# EAGLE design 20inputAND (EAGLE 7.5.0)
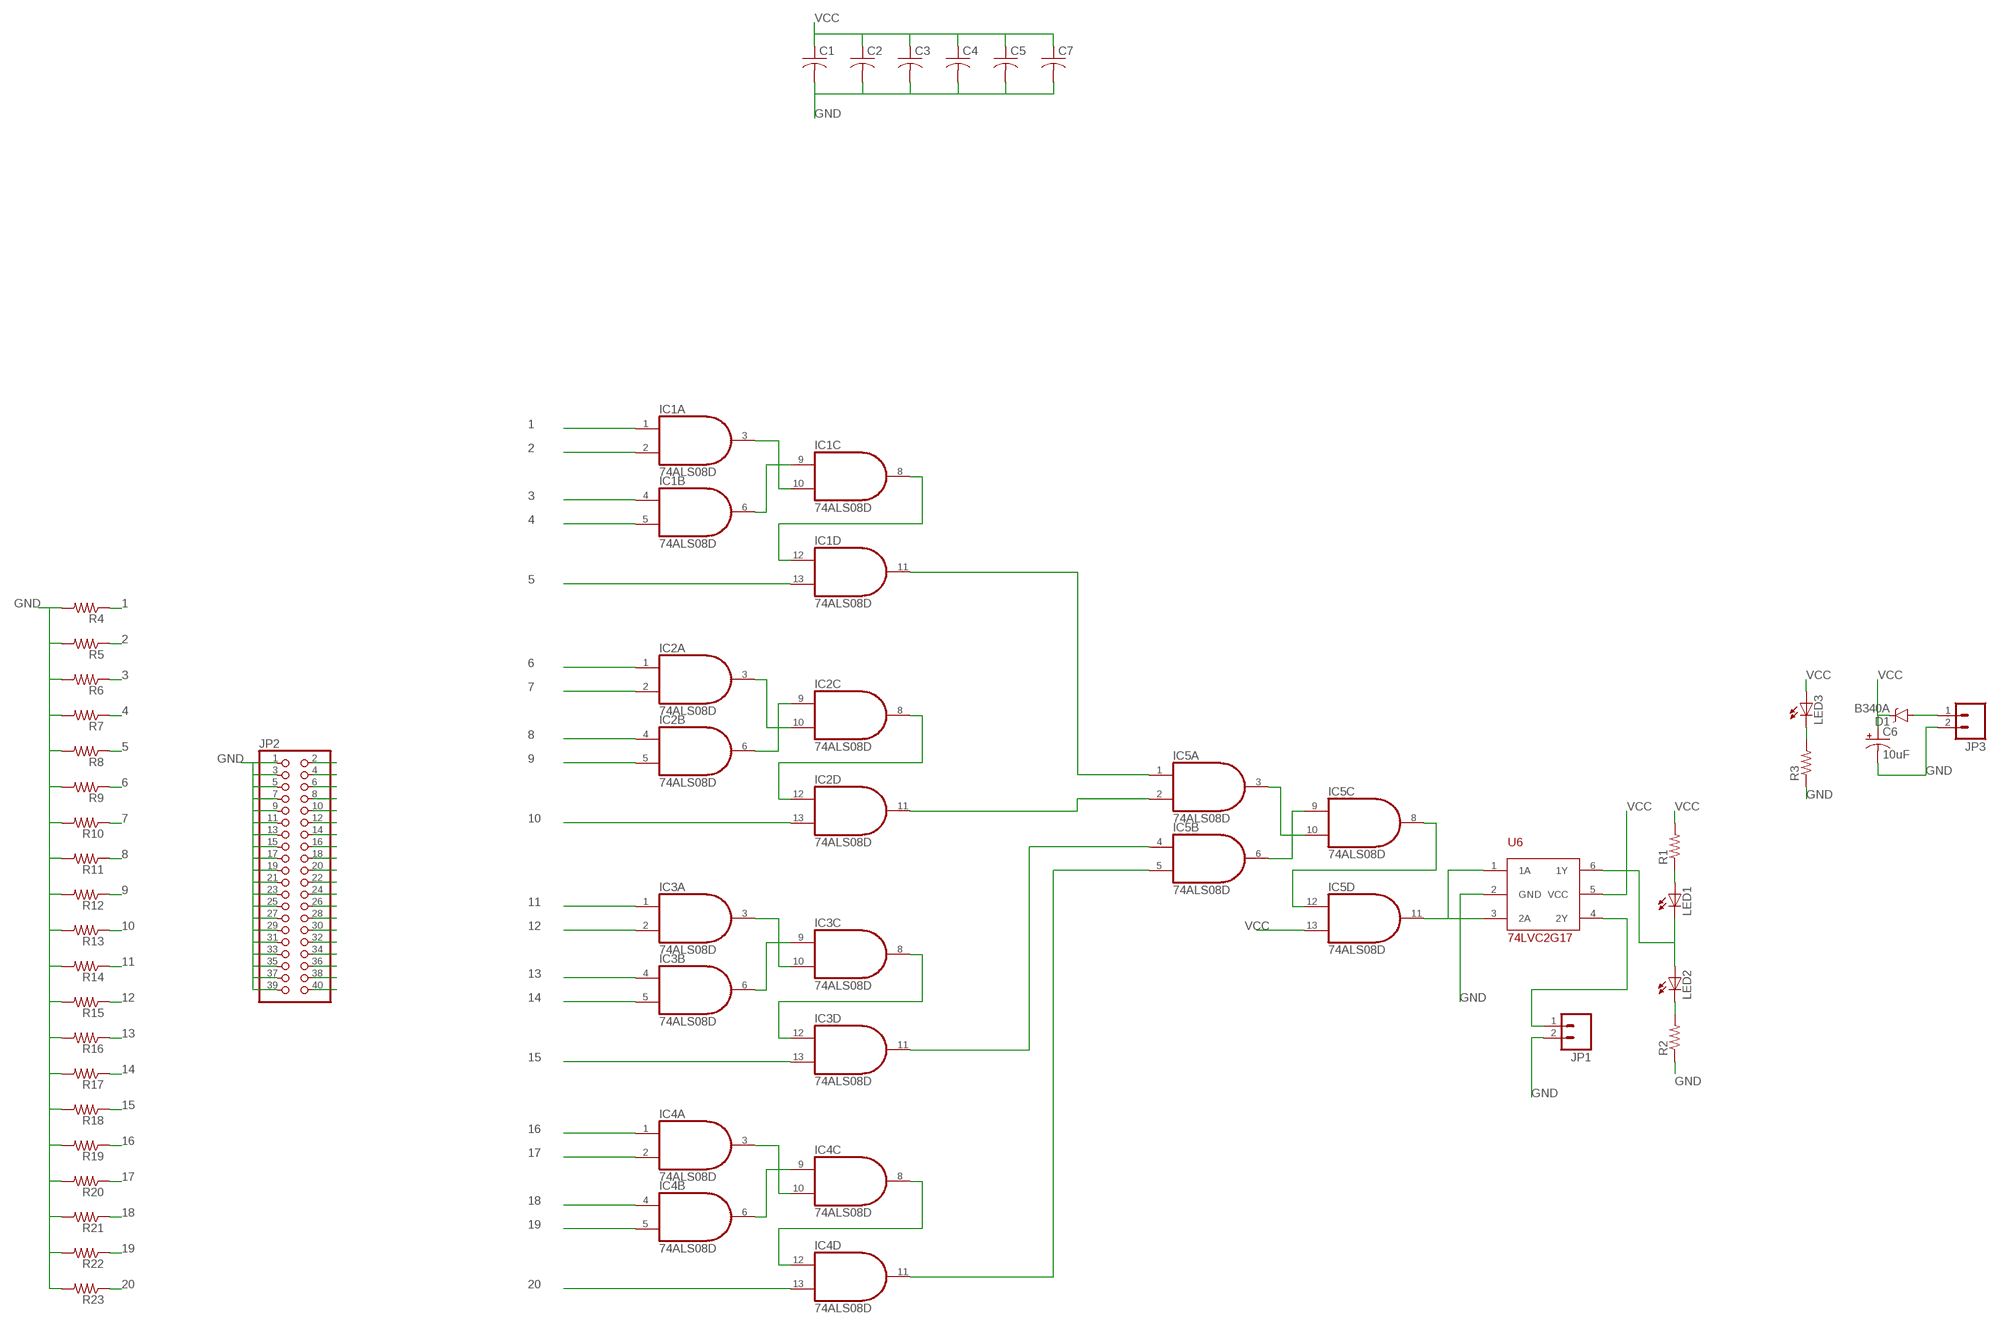
[diagram p0: schematic, sheet 1]

## Parts
C1  C-USC0603  [C0603]
C2  C-USC0603  [C0603]
C3  C-USC0603  [C0603]
C4  C-USC0603  [C0603]
C5  C-USC0603  [C0603]
C6  10uF  10UF-16V-10%(TANT)  [EIA3216]
C7  C-USC0603  [C0603]
D1  B340A  DIODE-SCHOTTKY-B340A  [SMA-DIODE]
IC1  74ALS08D  [SO14]
IC2  74ALS08D  [SO14]
IC3  74ALS08D  [SO14]
IC4  74ALS08D  [SO14]
IC5  74ALS08D  [SO14]
JP1  M02PTH  [1X02]
JP2  PINHD-2X20  [2X20]
JP3  M02PTH  [1X02]
LED1  LEDCHIPLED_1206  [CHIPLED_1206]
LED2  LEDCHIPLED_1206  [CHIPLED_1206]
LED3  LEDCHIPLED_0805  [CHIPLED_0805]
R1  R-US_R0603  [R0603]
R2  R-US_R0603  [R0603]
R3  R-US_R0603  [R0603]
R4  R-US_R0603  [R0603]
R5  R-US_R0603  [R0603]
R6  R-US_R0603  [R0603]
R7  R-US_R0603  [R0603]
R8  R-US_R0603  [R0603]
R9  R-US_R0603  [R0603]
R10  R-US_R0603  [R0603]
R11  R-US_R0603  [R0603]
R12  R-US_R0603  [R0603]
R13  R-US_R0603  [R0603]
R14  R-US_R0603  [R0603]
R15  R-US_R0603  [R0603]
R16  R-US_R0603  [R0603]
R17  R-US_R0603  [R0603]
R18  R-US_R0603  [R0603]
R19  R-US_R0603  [R0603]
R20  R-US_R0603  [R0603]
R21  R-US_R0603  [R0603]
R22  R-US_R0603  [R0603]
R23  R-US_R0603  [R0603]
U$2  74LVC2G14/7  [SOT23-6]

## Nets
1: IC1.1(A:I0) JP2.2 R4.1
2: IC1.2(A:I1) JP2.4 R5.1
3: IC1.4(B:I0) JP2.6 R6.1
4: IC1.5(B:I1) JP2.8 R7.1
5: IC1.13(D:I1) JP2.10 R8.1
6: IC2.1(A:I0) JP2.12 R9.1
7: IC2.2(A:I1) JP2.14 R10.1
8: IC2.4(B:I0) JP2.16 R11.1
9: IC2.5(B:I1) JP2.18 R12.1
10: IC2.13(D:I1) JP2.20 R13.1
11: IC3.1(A:I0) JP2.22 R14.1
12: IC3.2(A:I1) JP2.24 R15.1
13: IC3.4(B:I0) JP2.26 R16.1
14: IC3.5(B:I1) JP2.28 R17.1
15: IC3.13(D:I1) JP2.30 R18.1
16: IC4.1(A:I0) JP2.32 R19.1
17: IC4.2(A:I1) JP2.34 R20.1
18: IC4.4(B:I0) JP2.36 R21.1
19: IC4.5(B:I1) JP2.38 R22.1
20: IC4.13(D:I1) JP2.40 R23.1
GND: C1.2 C2.2 C3.2 C4.2 C5.2 C6.C(-) C7.2 JP1.2 JP2.1 JP2.3 JP2.5 JP2.7 JP2.9 JP2.11 JP2.13 JP2.15 JP2.17 JP2.19 JP2.21 JP2.23 JP2.25 JP2.27 JP2.29 JP2.31 JP2.33 JP2.35 JP2.37 JP2.39 JP3.2 R2.1 R3.1 R4.2 R5.2 R6.2 R7.2 R8.2 R9.2 R10.2 R11.2 R12.2 R13.2 R14.2 R15.2 R16.2 R17.2 R18.2 R19.2 R20.2 R21.2 R22.2 R23.2 U$2.2(GND)
N$1: LED1.A R1.1
N$2: D1.A JP3.1
N$3: LED2.C R2.2
N$5: IC1.6(B:O) IC1.9(C:I0)
N$6: IC1.3(A:O) IC1.10(C:I1)
N$7: IC1.8(C:O) IC1.12(D:I0)
N$8: LED3.C R3.2
N$9: IC1.11(D:O) IC5.1(A:I0)
N$11: IC2.3(A:O) IC2.10(C:I1)
N$12: IC2.6(B:O) IC2.9(C:I0)
N$13: IC3.6(B:O) IC3.9(C:I0)
N$14: IC3.3(A:O) IC3.10(C:I1)
N$15: IC2.8(C:O) IC2.12(D:I0)
N$16: IC4.6(B:O) IC4.9(C:I0)
N$17: IC4.3(A:O) IC4.10(C:I1)
N$18: IC2.11(D:O) IC5.2(A:I1)
N$19: IC5.6(B:O) IC5.9(C:I0)
N$20: IC5.3(A:O) IC5.10(C:I1)
N$21: LED1.C LED2.A U$2.6(1Y)
N$22: IC5.11(D:O) U$2.1(1A) U$2.3(2A)
N$24: IC3.8(C:O) IC3.12(D:I0)
N$25: JP1.1 U$2.4(2Y)
N$27: IC3.11(D:O) IC5.4(B:I0)
N$33: IC4.8(C:O) IC4.12(D:I0)
N$36: IC4.11(D:O) IC5.5(B:I1)
N$42: IC5.8(C:O) IC5.12(D:I0)
VCC: C1.1 C2.1 C3.1 C4.1 C5.1 C6.A(+) C7.1 D1.C IC5.13(D:I1) LED3.A R1.2 U$2.5(VCC)

## Notes on the sheet
- U6
- 74LVC2G17

## Power pins joined to a net without a drawn wire
GND: IC1.7(P:GND) IC2.7(P:GND) IC3.7(P:GND) IC4.7(P:GND) IC5.7(P:GND)
VCC: IC1.14(P:VCC) IC2.14(P:VCC) IC3.14(P:VCC) IC4.14(P:VCC) IC5.14(P:VCC)

## Library data of the parts
C1-C5 C7 = adafruit:C-US: CAPACITOR, American symbol
C6 = SparkFun-Capacitors:10UF-16V-10%(TANT): CAP-00811 1206/EIA-3216 Tantalum capacitor; PROD_ID: CAP-00811
D1 = SparkFun-DiscreteSemi:DIODE-SCHOTTKY: Schottky diodes in SFE's production catalog BAT20J 1A 23V 0.62Vf RB751 120mA 40V 0.37Vf PMEG4005EJ 0.5A 40V 0.42Vf MBRA140 1A 40V 0.5Vf B340A 3A 40V SMA; PROD_ID: DIO-09886
IC1-IC5 = 74xx-us:74*08: Quad 2-input AND gate
JP1 JP3 = SparkFun-Connectors:M02: Standard 2-pin 0.1" header. Use with - straight break away headers ( PRT-00116) - right angle break away headers (PRT-00553) - swiss pins (PRT-00743) - machine pins (PRT-00117) - female headers (PRT-00115) Molex polarized connector foot print use with: PRT-08233 with associated crimp pins and housings. 2.54_SCREWTERM for use with PRT-10571. 3.5mm Screw Terminal footprints for PRT-08084 5mm Screw Terminal footprints for use with PRT-08432
JP2 = adafruit:PINHD-2X20: PIN HEADER
LED1-LED3 = adafruit:LED: LED OSRAM: - CHIPLED LG R971, LG N971, LY N971, LG Q971, LY Q971, LO R971, LY R971 LH N974, LH R974 LS Q976, LO Q976, LY Q976 LO Q996 - Hyper CHIPLED LW Q18S LB Q993, LB Q99A, LB R99A - SideLED LS A670, LO A670, LY A670, LG A670, LP A670 LB A673, LV A673, LT A673, LW A673 LH A674 LY A675 LS A676, LA A676, LO A676, LY A676, LW A676 LS A679, LY A679, LG A679 - Hyper Micro SIDELED® LS Y876, LA Y876, LO Y876, LY Y876 LT Y87S - SmartLED LW L88C, LW L88S LB L89C, LB L89S, LG L890 LS L89K, LO L89K, LY L89K LS L896, LA L896, LO L896, LY L896 - TOPLED LS T670, LO T670, LY T670, LG T670, LP T670 LSG T670, LSP T670, LSY T670, LOP T670, LYG T670 LG T671, LOG T671, LSG T671 LB T673, LV T673, LT T673, LW T673 LH T674 LS T676, LA T676, LO T676, LY T676, LB T676, LH T676, LSB T676, LW T676 LB T67C, LV T67C, LT T67C, LS T67K, LO T67K, LY T67K, LW E67C LS E67B, LA E67B, LO E67B, LY E67B, LB E67C, LV E67C, LT E67C LW T67C LS T679, LY T679, LG T679 LS T770, LO T770, LY T770, LG T770, LP T770 LB T773, LV T773, LT T773, LW T773 LH T774 LS E675, LA E675, LY E675, LS T675 LS T776, LA T776, LO T776, LY T776, LB T776 LHGB T686 LT T68C, LB T68C - Hyper Mini TOPLED® LB M676 - Mini TOPLED Santana® LG M470 LS M47K, LO M47K, LY M47K Source: http://www.osram.convergy.de/
R1-R23 = adafruit:R-US_: RESISTOR, American symbol
U$2 = _CustomParts:74LVC2G14/7

## Board
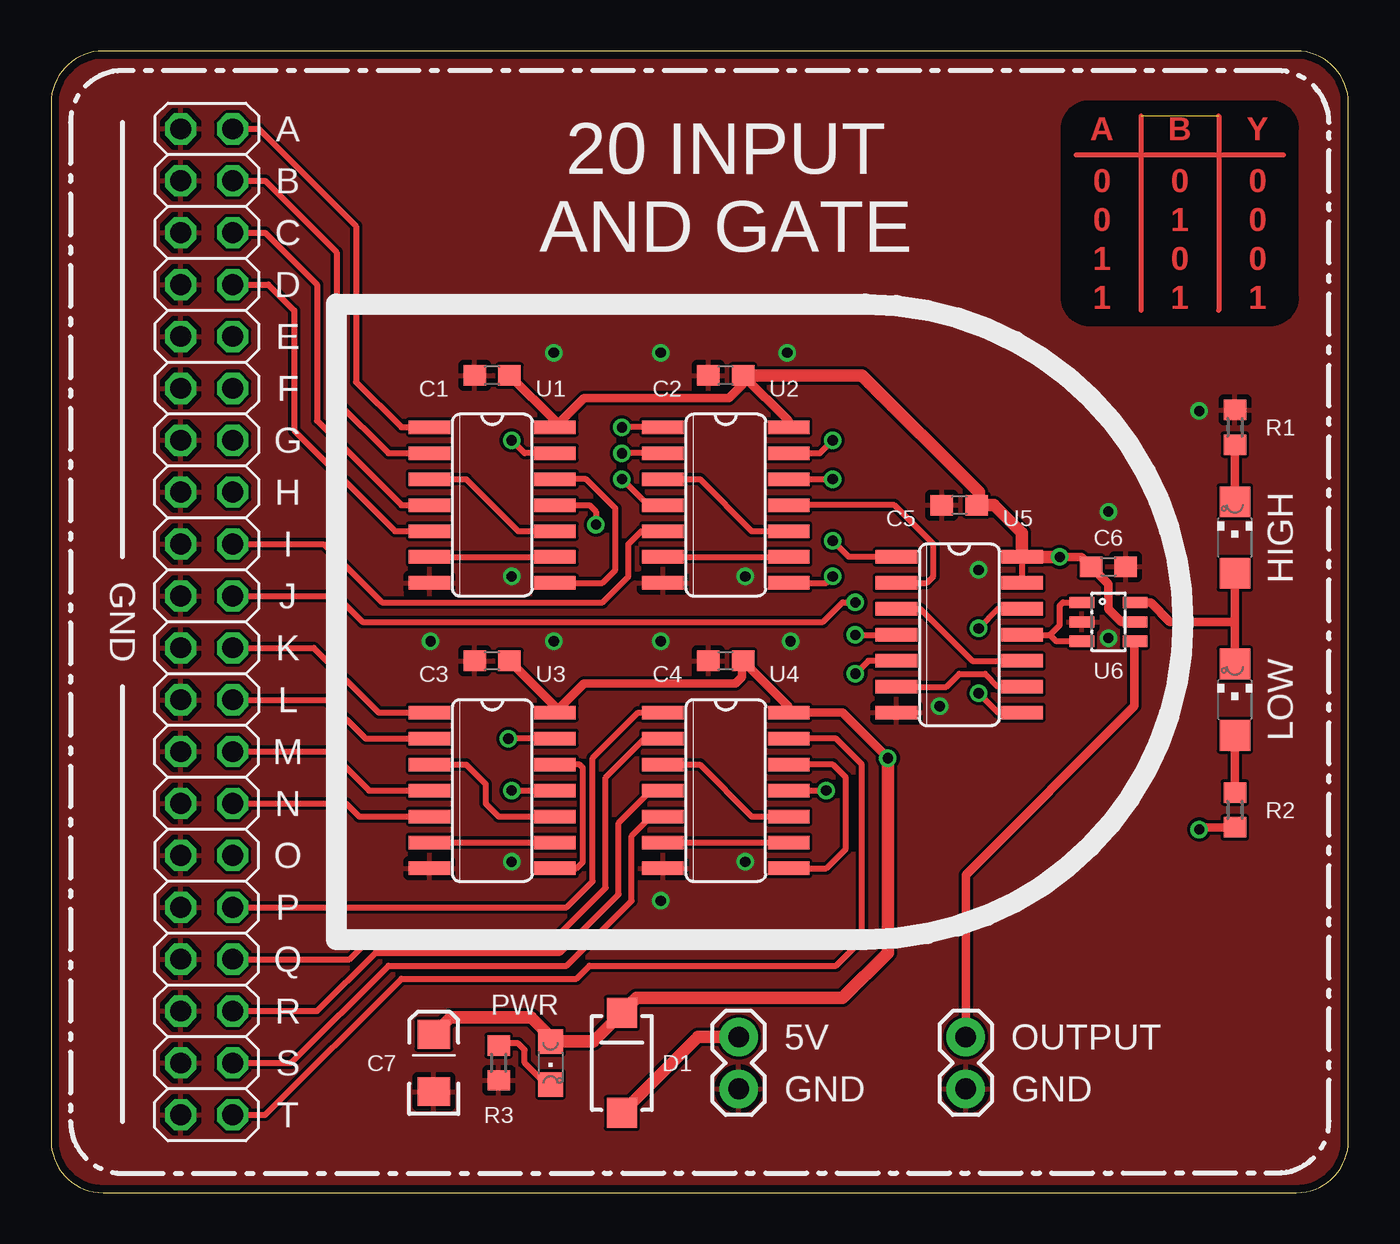
[diagram p1: board, top side]
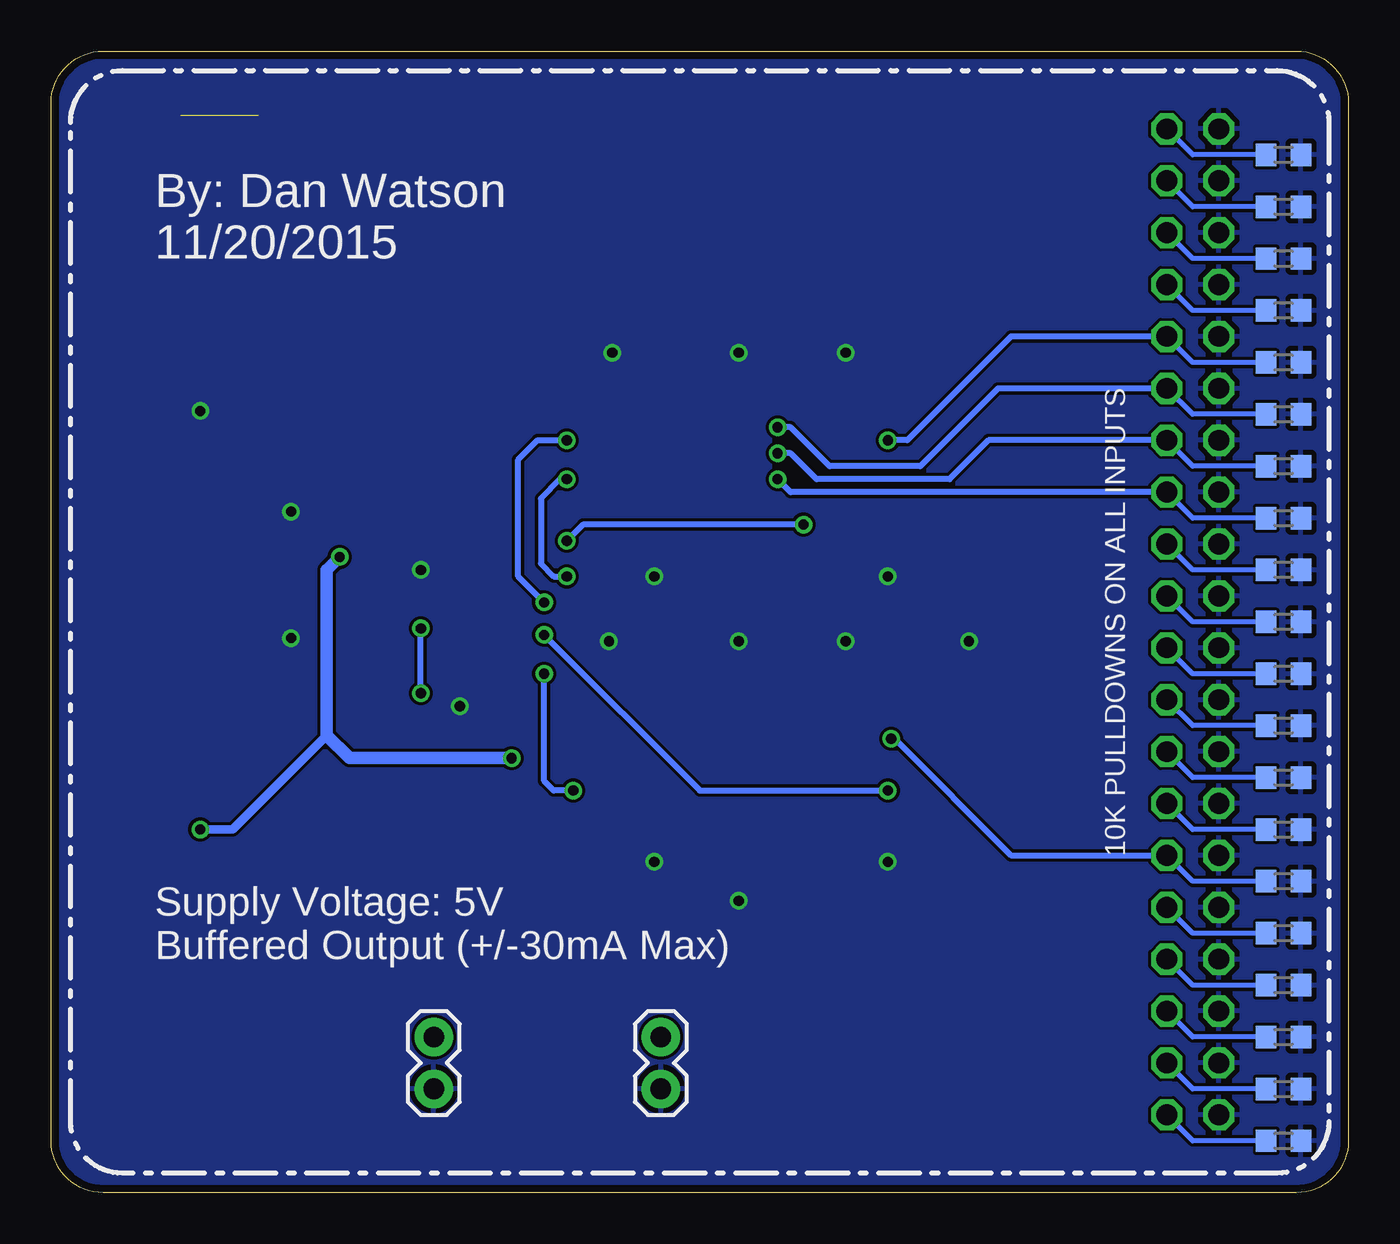
[diagram p2: board, bottom side, seen from below]

Size 63.5 x 55.88 mm. Coordinates in mm from the lower left corner, seen from the top.
Outline: 60.96,55.88 2.54,55.88 arc90 0,53.34 0,2.54 arc90 2.54,0 60.96,0 arc90 63.5,2.54 63.5,53.34 arc90 60.96,55.88
Copper layers (1*16): Top 0.0356mm / dielectric 1.5011mm / Bottom 0.0356mm
Design rules "LaenPCBOrder *": minimum track width 6mil, minimum drill 13mil, track to track 6mil, track to pad 6mil, pad to pad 6mil, via to via 6mil, smd to smd 6mil, copper to edge 15mil, drill to drill 6mil, minimum pad ring 7mil, minimum via ring 7mil, stop-mask expansion 3mil, vias tented up to drill 20mil, thermal gap 10mil
tRestrict: area 49.5,42.5 to 61,53.3

### Footprints (pad centres in the part's own frame; a part is rotated, then mirrored left to right if it is on the bottom)
C0603 = smd 1.1 x 1: 1 -0.85,0; 2 0.85,0
EIA3216 = smd 1.4 x 1.6: A 1.4,0; C -1.4,0
SMA-DIODE = smd 1.47 x 1.47: A -2.45,0; C 2.45,0
SO14 = smd 0.66 x 2.032: 1 -3.81,-3.073; 2 -2.54,-3.073; 3 -1.27,-3.073; 4 0,-3.073; 5 1.27,-3.073; 6 2.54,-3.073; 7 3.81,-3.073; 8 3.81,3.073; 9 2.54,3.073; 10 1.27,3.073; 11 0,3.073; 12 -1.27,3.073; 13 -2.54,3.073; 14 -3.81,3.073
1X02 = drill 1.016 pad 1.88: 1 0,0; 2 2.54,0
2X20 = drill 1.016 octagon: 1 0,0; 2 0,2.54; 3 2.54,0; 4 2.54,2.54; 5 5.08,0; 6 5.08,2.54; 7 7.62,0; 8 7.62,2.54; 9 10.16,0; 10 10.16,2.54; 11 12.7,0; 12 12.7,2.54; 13 15.24,0; 14 15.24,2.54; 15 17.78,0; 16 17.78,2.54; 17 20.32,0; 18 20.32,2.54; 19 22.86,0; 20 22.86,2.54; 21 25.4,0; 22 25.4,2.54; 23 27.94,0; 24 27.94,2.54; 25 30.48,0; 26 30.48,2.54; 27 33.02,0; 28 33.02,2.54; 29 35.56,0; 30 35.56,2.54; 31 38.1,0; 32 38.1,2.54; 33 40.64,0; 34 40.64,2.54; 35 43.18,0; 36 43.18,2.54; 37 45.72,0; 38 45.72,2.54; 39 48.26,0; 40 48.26,2.54
CHIPLED_1206 = smd 1.5 x 1.5: A 0,-1.75; C 0,1.75
CHIPLED_0805 = smd 1.2 x 1.2: A 0,-1.05; C 0,1.05
R0603 = smd 1 x 1.1: 1 -0.85,0; 2 0.85,0
SOT23-6 = smd 0.55 x 1.2: 1 -0.95,-1.3; 2 0,-1.3; 3 0.95,-1.3; 4 0.95,1.3; 5 0,1.3; 6 -0.95,1.3

### Placement (x,y rotation side)
C1  21.59,40 180 top
C2  21.59,26.04 180 top
C3  33.02,40 180 top
C4  33.02,26.04 180 top
C5  44.45,33.66 180 top
C6  18.73,6.35 90 top
C7  51.75,30.64 0 top
D1  27.94,6.35 90 top
IC1  21.59,33.66 270 top
IC2  33.02,33.66 270 top
IC3  21.59,19.69 270 top
IC4  33.02,19.69 270 top
IC5  44.45,27.3 270 top
JP1  44.77,7.62 270 top
JP2  6.35,52.07 270 top
JP3  33.66,7.62 270 top
LED1  57.94,24.13 0 top
LED2  57.94,32.07 0 top
LED3  24.45,6.35 180 top
R1  57.94,18.73 270 top
R2  57.94,37.46 270 top
R3  21.91,6.35 90 top
R4  3.17,50.8 0 bottom
R5  3.17,48.26 0 bottom
R6  3.17,45.72 0 bottom
R7  3.17,43.18 0 bottom
R8  3.17,40.64 0 bottom
R9  3.17,38.1 0 bottom
R10  3.17,35.56 0 bottom
R11  3.17,33.02 0 bottom
R12  3.17,30.48 0 bottom
R13  3.17,27.94 0 bottom
R14  3.17,25.4 0 bottom
R15  3.17,22.86 0 bottom
R16  3.17,20.32 0 bottom
R17  3.17,17.78 0 bottom
R18  3.17,15.24 0 bottom
R19  3.17,12.7 0 bottom
R20  3.17,10.16 0 bottom
R21  3.17,7.62 0 bottom
R22  3.17,5.08 0 bottom
R23  3.17,2.54 0 bottom
U$2  51.75,27.94 270 top

### Tracks (layer width: path | path; a pad name or v marks a point on that pad's centre or on a via)
1
  Top 0.305: JP2.2 10.16,52.07 14.92,47.31 14.92,39.69 17.14,37.46 IC1.1
  Bottom 0.254: R4.1 7.62,50.8 JP2.2
2
  Top 0.305: JP2.4 10.48,49.53 13.97,46.04 13.97,38.73 16.51,36.2 IC1.2
  Bottom 0.254: R5.1 7.62,48.26 JP2.4
3
  Top 0.305: JP2.6 10.48,46.99 13.02,44.45 13.02,37.78 17.14,33.66 IC1.4
  Bottom 0.254: R6.1 7.62,45.72 JP2.6
4
  Top 0.305: JP2.8 10.64,44.45 11.91,43.18 11.91,37.31 16.83,32.38 IC1.5
  Bottom 0.254: R7.1 7.62,43.18 JP2.8
5  (via drill 0.5)
  Top 0.305: IC1.13 23.18,36.2 v22.54,36.83
  Bottom 0.254: R8.1 7.62,40.64 JP2.10
  Bottom 0.305: JP2.10 16.51,41.91 21.59,36.83 v22.54,36.83
6  (via drill 0.5)
  Top 0.305: IC2.1 v27.94,37.46
  Bottom 0.254: R9.1 7.62,38.1 JP2.12
  Bottom 0.305: JP2.12 17.14,39.37 20.95,35.56 25.4,35.56 27.3,37.46 v27.94,37.46
7  (via drill 0.5)
  Top 0.305: IC2.2 v27.94,36.2
  Bottom 0.254: R10.1 7.62,35.56 JP2.14
  Bottom 0.305: JP2.14 17.62,36.83 19.53,34.92 26.04,34.92 27.3,36.2 v27.94,36.2
8  (via drill 0.5)
  Top 0.305: IC2.4 29.21,33.66 v27.94,34.92
  Bottom 0.254: R11.1 7.62,33.02 JP2.16
  Bottom 0.305: JP2.16 27.3,34.29 v27.94,34.92
9
  Top 0.305: JP2.18 13.34,31.75 16.19,28.89 26.99,28.89 28.26,30.16 28.26,31.75 28.89,32.38 IC2.5
  Bottom 0.254: R12.1 7.62,30.48 JP2.18
10  (via drill 0.5)
  Top 0.305: JP2.20 13.97,29.21 15.24,27.94 37.78,27.94 38.73,28.89 v39.37,28.89 | IC2.13 37.62,36.2 v38.26,36.83
  Bottom 0.254: R13.1 7.62,27.94 JP2.20
  Bottom 0.305: v39.37,28.89 40.64,30.16 40.64,35.88 39.69,36.83 v38.26,36.83
11
  Top 0.305: JP2.22 12.86,26.67 16.03,23.5 IC3.1
  Bottom 0.254: R14.1 7.62,25.4 JP2.22
12
  Top 0.305: JP2.24 13.49,24.13 15.4,22.23 IC3.2
  Bottom 0.254: R15.1 7.62,22.86 JP2.24
13
  Top 0.305: JP2.26 13.65,21.59 15.56,19.69 IC3.4
  Bottom 0.254: R16.1 7.62,20.32 JP2.26
14
  Top 0.305: JP2.28 14.45,19.05 15.08,18.42 IC3.5
  Bottom 0.254: R17.1 7.62,17.78 JP2.28
15  (via drill 0.5)
  Top 0.305: IC3.13 v22.38,22.23
  Bottom 0.254: R18.1 7.62,15.24 JP2.30
  Bottom 0.305: v22.38,22.23 22.23,22.23 16.51,16.51 JP2.30
16
  Top 0.305: JP2.32 25.24,13.97 26.51,15.24 26.51,21.27 28.73,23.5 IC4.1
  Bottom 0.254: R19.1 7.62,12.7 JP2.32
17
  Top 0.305: JP2.34 14.61,11.43 15.56,12.38 24.61,12.38 27.15,14.92 27.15,20.32 29.05,22.23 IC4.2
  Bottom 0.254: R20.1 7.62,10.16 JP2.34
18
  Top 0.305: JP2.36 13.02,8.89 15.88,11.75 24.92,11.75 27.78,14.6 27.78,18.1 29.37,19.69 IC4.4
  Bottom 0.254: R21.1 7.62,7.62 JP2.36
19
  Top 0.305: JP2.38 11.75,6.35 16.51,11.11 25.24,11.11 28.42,14.29 28.42,17.46 29.37,18.42 IC4.5
  Bottom 0.254: R22.1 7.62,5.08 JP2.38
20
  Top 0.305: JP2.40 10.48,3.81 17.14,10.48 25.72,10.48 26.35,11.11 38.42,11.11 39.69,12.38 39.69,20.96 38.42,22.23 IC4.13
  Bottom 0.254: R23.1 7.62,2.54 JP2.40
GND  (via drill 0.5)
  other vias: 36.2,26.99 29.84,26.99 24.61,26.99 18.57,26.99 24.61,41.12 29.84,41.12 36.04,41.12 29.84,14.29 33.97,30.16 22.54,30.16 22.54,16.19 33.97,16.19 45.4,30.48 43.5,23.81 51.75,27.15 51.75,33.34 56.2,38.26
  pour Top: -3.81,57.15 -3.81,-2.54 64.77,-2.54 64.77,58.42 -3.81,58.42
  pour Bottom: -6.35,59.69 -6.35,-5.08 67.31,-5.08 67.31,60.96 -6.35,60.96
N$1
  Top 0.406: LED1.A R1.1
N$2
  Top 0.61: JP3.1 31.66,7.62 D1.A
N$3
  Top 0.406: LED2.C R2.2
N$4
  Top 0.254: 50.16,50.8 60.33,50.8
N$5
  Top 0.305: IC1.6 IC1.9
N$6
  Top 0.305: IC1.3 20.32,34.92 22.86,32.38 IC1.10
N$7
  Top 0.305: IC1.8 26.99,29.85 27.62,30.48 27.62,33.5 26.19,34.92 IC1.12
N$8
  Top 0.305: LED3.C 24.23,5.3 23.18,6.35 23.18,6.98 22.86,7.3 22.01,7.3 R3.2
N$9  (via drill 0.5)
  Top 0.305: IC5.1 39.05,31.11 v38.26,31.91 | IC1.11 26.35,33.66 26.67,33.34 v26.67,32.7
  Bottom 0.305: v26.67,32.7 37.47,32.7 v38.26,31.91
N$10  (1 unrouted)
  Top 0.254: 53.34,52.7 53.34,43.18 | 57.15,52.7 57.15,43.18
N$11
  Top 0.305: IC2.3 31.75,34.92 34.29,32.38 IC2.10
N$12
  Top 0.305: IC2.6 IC2.9
N$13
  Top 0.305: IC3.6 IC3.9
N$14
  Top 0.305: IC3.3 20.32,20.96 21.27,20 21.27,19.05 21.91,18.42 IC3.10
N$15  (via drill 0.5)
  Top 0.305: IC2.12 v38.26,34.92 | IC2.8 37.94,29.85 v38.26,30.16
  Bottom 0.305: v38.26,34.92 38.58,34.92 39.53,33.97 39.53,30.8 38.89,30.16 v38.26,30.16
N$16
  Top 0.305: IC4.6 IC4.9
N$17
  Top 0.305: IC4.3 31.75,20.96 34.29,18.42 IC4.10
N$18
  Top 0.305: IC5.2 42.86,29.85 43.18,30.16 43.18,31.75 41.27,33.66 IC2.11
N$19
  Top 0.305: IC5.6 43.81,24.77 44.45,25.4 45.72,25.4 46.35,24.77 IC5.9
N$20
  Top 0.305: IC5.3 42.55,28.57 45.09,26.04 IC5.10
N$21
  Top 0.406: LED2.A 57.94,27.94 | 57.94,27.94 LED1.C | U$2.6 53.82,28.89 54.77,27.94 57.94,27.94
N$22
  Top 0.305: IC5.11 48.9,27.3 | 48.9,27.3 49.37,27.78 49.37,28.73 49.53,28.89 50.13,28.89 U$2.1 | U$2.3 49.21,26.99 48.9,27.3
N$24
  Top 0.305: IC3.8 25.72,15.87 26.04,16.19 26.04,20.8 25.88,20.96 IC3.12
N$25
  Top 0.406: JP1.1 44.77,15.56 53.02,23.81 53.02,26.96 U$2.4
N$27  (via drill 0.5)
  Top 0.305: v22.54,19.69 IC3.11 | v39.37,27.3 IC5.4
  Bottom 0.305: v39.37,27.3 31.75,19.69 v22.54,19.69
N$33
  Top 0.305: IC4.8 37.94,15.87 38.89,16.83 38.89,20.32 38.26,20.96 IC4.12
N$36  (via drill 0.5)
  Top 0.305: IC4.11 v37.94,19.69 | IC5.5 40.01,26.04 v39.37,25.4
  Bottom 0.305: v37.94,19.69 38.89,19.69 39.37,20.16 v39.37,25.4
N$42  (via drill 0.5)
  Top 0.305: IC5.12 46.35,28.57 v45.4,27.62 | IC5.8 46.35,23.5 v45.4,24.45
  Bottom 0.305: v45.4,24.45 v45.4,27.62
VCC  (via drill 0.5)
  Top 0.305: IC5.14 IC5.13 | IC3.14 24.66,23.81 | C3.1 33.87,39.59 | 33.81,25.98 C4.1
  Top 0.406: 45.09,33.87 C5.1 | IC2.14 36.09,37.78 C3.1 33.87,40.11 | C1.1 24.66,37.78 IC1.14 26.09,38.89 33.18,38.89 33.87,39.59 | LED3.A 24.45,7.62 | 24.66,23.81 C2.1 | IC3.14 26.09,24.92 33.5,24.92 33.81,25.24 33.81,25.98 | v40.96,21.27 38.73,23.5 IC4.14 36.09,23.81 C4.1 | R1.2 56.3,17.88 v56.2,17.78 | U$2.5 52.39,27.94 51.75,28.57 51.75,29.79 C7.1 50.43,31.11 v49.37,31.11
  Top 0.61: C3.1 39.69,40 45.4,34.29 45.4,33.76 C5.1 46.15,33.66 47.52,32.28 IC5.14 v49.37,31.11 | LED3.A 26.54,7.4 D1.C 28.66,9.53 38.73,9.53 40.96,11.75 v40.96,21.27 | 24.45,7.62 23.5,8.57 19.55,8.57 C6.A
  Bottom 0.406: v56.2,17.78 54.61,17.78 50.01,22.38
  Bottom 0.61: v40.96,21.27 48.9,21.27 50.01,22.38 50.01,30.48 v49.37,31.11

### Text on the board
Top: A | B | Y | 0 | 0 | 0 | 0 | 1 | 0 | 1 | 0 | 0 | 1 | 1 | 1
tNames: A | B | 20 INPUT / AND GATE | C | D | E | F | C1 | U1 | C2 | U2 | G | R1 | H | C5 | U5 | I | C6 | HIGH | J | GND | K | C3 | U3 | C4 | U4 | U6 | L | LOW | M | N | R2 | O | P | Q | R | PWR | 5V | OUTPUT | S | C7 | D1 | GND | GND | T | R3
bNames: By: Dan Watson / 11/20/2015 | 10K PULLDOWNS ON ALL INPUTS | Supply Voltage: 5V / Buffered Output (+/-30mA Max)